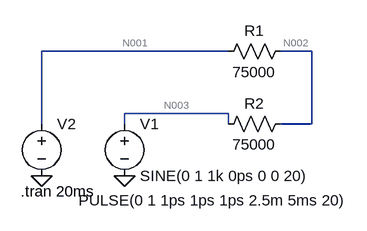
[diagram p0: schematic lab1.asc]
lab1.asc, the LTspice schematic file:
Version 4
SHEET 1 880 680
WIRE 176 128 -112 128
WIRE 304 128 256 128
WIRE 304 192 304 128
WIRE 176 224 16 224
WIRE -112 240 -112 128
WIRE 16 240 16 224
WIRE 176 240 176 224
WIRE 304 240 304 192
WIRE 304 240 256 240
FLAG 16 320 0
FLAG -112 320 0
DATAFLAG 304 192 ""
SYMBOL res 272 112 R90
WINDOW 0 0 56 VBottom 2
WINDOW 3 32 56 VTop 2
SYMATTR InstName R1
SYMATTR Value 75000
SYMBOL res 272 224 R90
WINDOW 0 0 56 VBottom 2
WINDOW 3 32 56 VTop 2
SYMATTR InstName R2
SYMATTR Value 75000
SYMBOL voltage 16 224 R0
WINDOW 123 0 0 Left 2
WINDOW 39 0 0 Left 2
SYMATTR InstName V1
SYMATTR Value SINE(0 1 1k 0ps 0 0 20)
SYMBOL voltage -112 224 R0
WINDOW 123 24 124 Left 2
WINDOW 39 0 0 Left 2
WINDOW 3 57 134 Left 2
SYMATTR InstName V2
SYMATTR Value PULSE(0 1 1ps 1ps 1ps 2.5m 5ms 20)
TEXT -144 344 Left 2 !.tran 20ms

The netlist it stands for:
* lab1.asc
R1 N002 N001 75000
R2 N002 N003 75000
V1 N003 0 SINE(0 1 1k 0ps 0 0 20)
V2 N001 0 PULSE(0 1 1ps 1ps 1ps 2.5m 5ms 20)
.tran 20ms
.backanno
.end

* Results of the author's LTspice run, read from the files saved beside the schematic
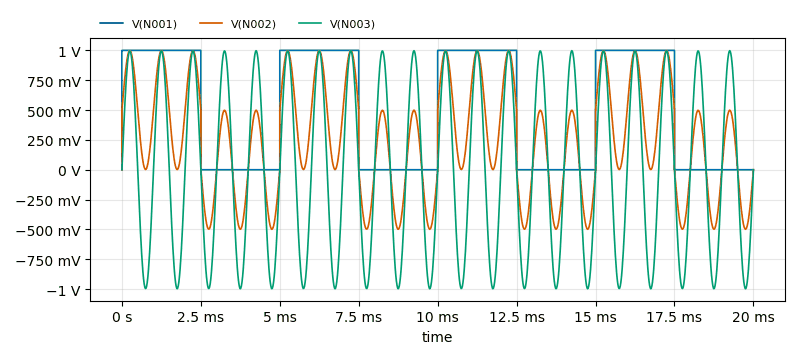
[diagram p1: Transient Analysis of lab1.asc, plotted from the saved traces]
* Transient Analysis, 1 run:
*   V(N001): min -227.9 nV, max 1 V, average 500 mV, rms 707.1 mV, last 0 V
*   V(N002): min -498.8 mV, max 998.8 mV, average 250 mV, rms 529.9 mV, last 0 V
*   V(N003): min -997.6 mV, max 997.6 mV, average 0 V, rms 704.6 mV, last 0 V